# Altium schematic sheet System Power.SchDoc
size 297 x 209 mm; CompanyName: Sainsbury Wellcome Centre; Organization: FabLab; Address1: Sainsbury Wellcome Centre; Address2: 25 Howland Street; Address3: London; Address4: W1T 4JG; DocumentNumber: 2; SheetNumber: 2; SheetTotal: 3; swcgroup: FabLab; Org: Sainsbury Wellcome Centre; Add1: 25 Howland Street; Add2: London; Add3: W1T 4JG; WebAddress: www.sainsburywellcome.org; SheetSize: A4; SheetName: System Power
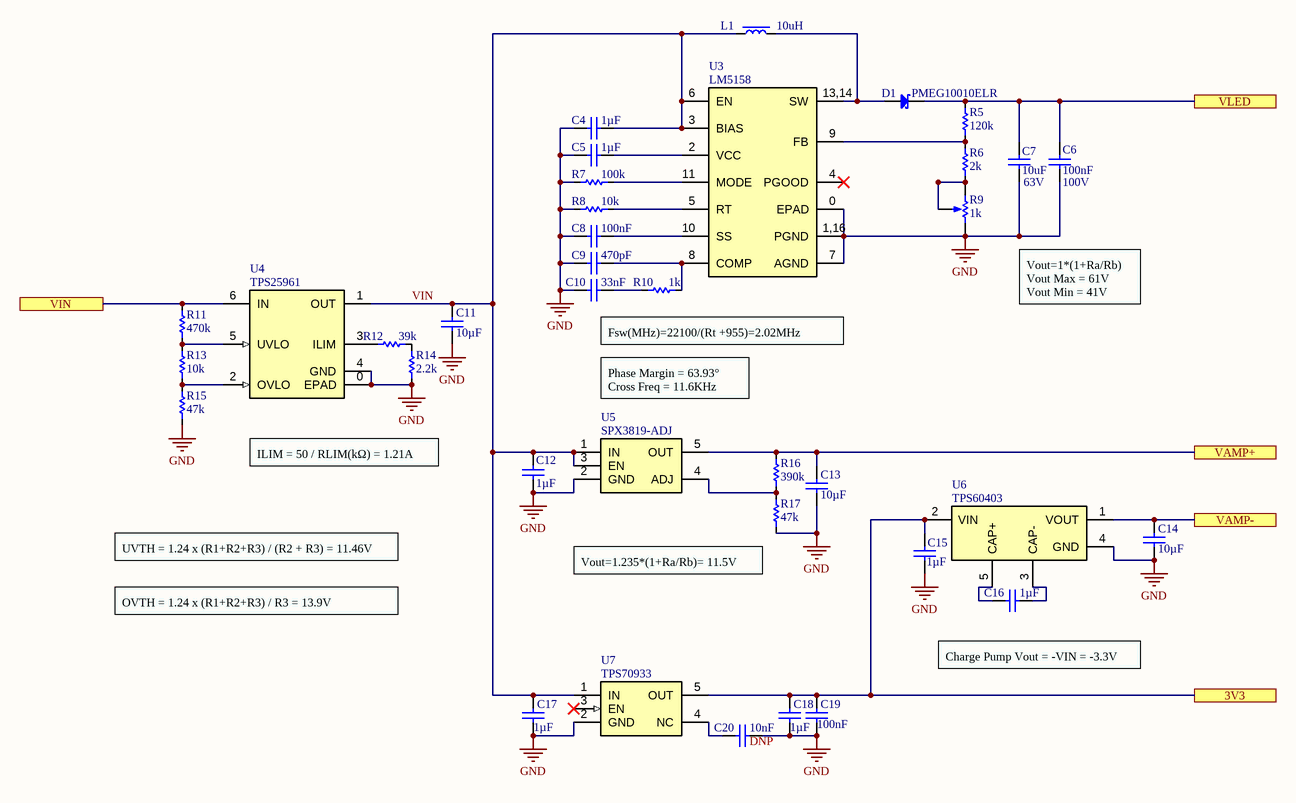
[diagram p0: System Power.SchDoc]

## Parts
C4  value 1µF  [CAP_CHIP_0603]  (hidden comment: C0603-1uF-50V)
C5  value 1µF  [CAP_CHIP_0603]  (hidden comment: C0603-1uF-50V)
C6  value 100nF  Voltage Rating: 100V  [CAP_CHIP_0603]  (hidden comment: C0603-100nF-100V)
C7  value 10uF  Voltage Rating: 63V  [CAP_CHIP_1210]  (hidden comment: C1210-10uF-63V)
C8  value 100nF  [CAP_CHIP_0603]  (hidden comment: C0603-100nF-50V)
C9  value 470pF  [CAP_CHIP_0603]  (hidden comment: C0603-470pF-25V)
C10  value 33nF  [CAP_CHIP_0603]  (hidden comment: C0603-33nF-50V)
C11  value 10µF  [CAP_CHIP_0603]  (hidden comment: C0603-10uF-25V)
C12  value 1µF  [CAP_CHIP_0603]  (hidden comment: C0603-1uF-50V)
C13  value 10µF  [CAP_CHIP_0603]  (hidden comment: C0603-10uF-25V)
C14  value 10µF  [CAP_CHIP_0603]  (hidden comment: C0603-10uF-25V)
C15  value 1µF  [CAP_CHIP_0603]  (hidden comment: C0603-1uF-50V)
C16  value 1µF  [CAP_CHIP_0603]  (hidden comment: C0603-1uF-50V)
C17  value 1µF  [CAP_CHIP_0603]  (hidden comment: C0603-1uF-50V)
C18  value 1µF  [CAP_CHIP_0603]  (hidden comment: C0603-1uF-50V)
C19  value 100nF  [CAP_CHIP_0603]  (hidden comment: C0603-100nF-50V)
C20  value 10nF  LCSC Part N.: DNP  [CAP_CHIP_0603]  (hidden comment: C0603-10nF-50V)
D1  PMEG10010ELR  [SOD123]
L1  value 10uH  [IND_PWR_0404]  (hidden comment: L-PWR-10uH-1.5A)
R5  value 120k  [RES_CHIP_0603]  (hidden comment: R0603-120K)
R6  value 2k  [RES_CHIP_0603]  (hidden comment: R0603-2K)
R7  value 100k  [RES_CHIP_0603]  (hidden comment: R0603-100K)
R8  value 10k  [RES_CHIP_0603]  (hidden comment: R0603-10K)
R9  value 1k  [VR_SMD_4.5mm]  (hidden comment: VR-SMD-1K-B)
R10  value 1k  [RES_CHIP_0603]  (hidden comment: R0603-1K)
R11  value 470k  [RES_CHIP_0603]  (hidden comment: R0603-470K)
R12  value 39k  [RES_CHIP_0603]  (hidden comment: R0603-39K)
R13  value 10k  [RES_CHIP_0603]  (hidden comment: R0603-10K)
R14  value 2.2k  [RES_CHIP_0603]  (hidden comment: R0603-2K2)
R15  value 47k  [RES_CHIP_0603]  (hidden comment: R0603-47K)
R16  value 390k  [RES_CHIP_0603]  (hidden comment: R0603-390K)
R17  value 47k  [RES_CHIP_0603]  (hidden comment: R0603-47K)
U3  LM5158  [QFN16_3X3_0.5E_EP]
U4  TPS25961  [WSON6]
U5  SPX3819-ADJ  [SOT23-5]
U6  TPS60403  [SOT23-5]
U7  TPS70933  [SOT23-5]

## Ports
3V3, VAMP+, VAMP-, VIN, VLED

## Nets
GND: C4.2 C5.2 C6.1 C7.1 C8.2 C9.2 C10.2 C11.2 C12.1 C13.2 C14.2 C15.2 C17.1 C18.1 C19.1 C20.1 R7.2 R8.2 R9.3(BOT) R14.1 R15.1 R17.1 U3.0(EPAD) U3.1,16(PGND) U3.7(AGND) U4.0(EPAD) U4.4(GND) U5.2(GND) U6.4(GND) U7.2(GND)
3V3: C15.1 C18.2 C19.2 U6.2(VIN) U7.5(OUT) ; port 3V3
VAMP+: C13.1 R16.2 U5.5(OUT) ; port VAMP+
VAMP-: C14.1 U6.1(VOUT) ; port VAMP-
VIN: C4.1 C11.1 C12.2 C17.2 L1.1 U3.3(BIAS) U3.6(EN) U4.1(OUT) U5.1(IN) U5.3(EN) U7.1(IN)
VIN: R11.2 U4.6(IN) ; port VIN  [a separate net that carries the same name]
VLED: C6.2 C7.2 D1.1(C) R5.2 ; port VLED
NetC5_1: C5.1 U3.2(VCC)
NetC8_1: C8.1 U3.10(SS)
NetC9_1: C9.1 R10.1 U3.8(COMP)
NetC10_1: C10.1 R10.2
NetC16_1: C16.1 U6.5(CAP+)
NetC16_2: C16.2 U6.3(CAP-)
NetC20_2: C20.2 U7.4(NC)
NetD1_2: D1.2(A) L1.2 U3.13,14(SW)
NetR5_1: R5.1 R6.2 U3.9(FB)
NetR6_1: R6.1 R9.1(TOP) R9.2(TAP)
NetR7_1: R7.1 U3.11(MODE)
NetR8_1: R8.1 U3.5(RT)
NetR11_1: R11.1 R13.2 U4.5(UVLO)
NetR12_1: R12.1 R14.2
NetR12_2: R12.2 U4.3(ILIM)
NetR13_1: R13.1 R15.2 U4.2(OVLO)
NetR16_1: R16.1 R17.2 U5.4(ADJ)

Not connected (* = marked no-connect by the designer): U3 4(PGOOD)*; U7 3(EN)*

## Notes on the sheet
- Vout=1*(1+Ra/Rb)
  Vout Max = 61V
  Vout Min = 41V
- Fsw(MHz)=22100/(Rt +955)=2.02MHz
- Phase Margin = 63.93°
  Cross Freq = 11.6KHz
- ILIM = 50 / RLIM(kΩ) = 1.21A
- UVTH = 1.24 x (R1+R2+R3) / (R2 + R3) = 11.46V
- (near R17) Vout=1.235*(1+Ra/Rb)= 11.5V
- OVTH = 1.24 x (R1+R2+R3) / R3 = 13.9V
- (near C16) Charge Pump Vout = -VIN = -3.3V
- FILE
- VARIANT
- DATE
- REVISION
- SHEET
- /
- PROJECT
- SIZE

## Library data of the parts
C4 C5 C12 C15-C18 = CMP-611-0033-11: 0603 Multilayer Ceramic Capacitors MLCC; PartNumber: CL10A105KB8NNNC; Pick&PlaceFootprint: C0603; Voltage Rating: 50V; Dielectric: X5R; Tolerance: 10%; Case/Package: 0603; RoHS: Yes; Capacitor Type: Ceramic; Mount: SMD; LCSC Part N.: C15849
C6 = CMP-611-0088-1: 0603 0.1 uF 100 V ±10% Tolerance X7R Multilayer Ceramic Capacitor; PartNumber: CC0603KRX7R0BB104; Pick&PlaceFootprint: C0603; Case/Package: 0603; LCSC Part N.: C113803; Tolerance: 10%; Dielectric: X7R; RoHS: Yes; Mount: SMD; Capacitor Type: Ceramic
C7 = CMP-611-0087-1: Multilayer Ceramic Capacitors MLCC - SMD/SMT 1210 10uF 63volts *Derate Voltage/Temp; PartNumber: GRM32ER71J106KA12L; Pick&PlaceFootprint: C1210; Dielectric: X7R; Tolerance: 10%; Mount: Surface Mount; Case/Package: 1210; LCSC Part N.: C437568; Capacitor Type: Ceramic
C8 C19 = CMP-611-0027-24: 0603 Multilayer Ceramic Capacitors MLCC; PartNumber: CC0603KRX7R9BB104; Tolerance: 10%; Pick&PlaceFootprint: C0603; Dielectric: X7R; Voltage Rating: 50V; Capacitor Type: Ceramic; RoHS: Yes; Mount: SMD; LCSC Part N.: C14663; Case/Package: 0603
C9 = CMP-611-0076-2: 25V 470pF X7R ±10% 0603 Multilayer Ceramic Capacitors MLCC - SMD/SMT ROHS; PartNumber: CC0603KRX7R8BB471; Pick&PlaceFootprint: C0603; RoHS: Yes; Capacitor Type: Ceramic; Dielectric: X7R; Mount: SMD; Case/Package: 0603; Tolerance: 10%; Voltage Rating: 25V; LCSC Part N.: C519413
C10 = CMP-611-0085-1: 0603 Multilayer Ceramic Capacitors MLCC; PartNumber: CL10B333KB8NNNC; Tolerance: 10%; Voltage Rating: 50V; Dielectric: X7R; Pick&PlaceFootprint: C0603; Case/Package: 0603; Mount: SMD; Capacitor Type: Ceramic; RoHS: Yes; LCSC Part N.: C21117
C11 C13 C14 = CMP-611-0050-6: 0603 Multilayer Ceramic Capacitors MLCC; PartNumber: CL10A106MA8NRNC; Dielectric: X5R; Pick&PlaceFootprint: C0603; Voltage Rating: 25V; Tolerance: 20%; Case/Package: 0603; LCSC Part N.: C96446; RoHS: Yes; Capacitor Type: Ceramic; Mount: SMD
C20 = CMP-611-0022-7: 0603 Multilayer Ceramic Capacitors MLCC; PartNumber: 0603B103K500NT; Pick&PlaceFootprint: C0603; Voltage Rating: 50V; Dielectric: X7R; Tolerance: 10%; Case/Package: 0603; RoHS: Yes; Capacitor Type: Ceramic; Mount: SMD
D1 = CMP-821-0014-1: On a Reel of 3000, Nexperia 100V 1.4A, Schottky Diode, 2-Pin SOD-123W PMEG10010ELRX; Rectified Current: 1A; Forward Voltage: 770mV; PartNumber: PMEG10010ELRX; Max Reverse Voltage: 100V; Pick&PlaceFootprint: SOD123; LCSC Part N.: C179426
L1 = CMP-620-0021-1: Inductor Power Shielded Wirewound 10uH 20% 100KHz Metal 1.5A 0.345Ohm DCR T/R; PartNumber: SPM4015T-100M-LR; DC Resistance (DCR): 345mR; Saturation Current: 1.9A; Tolerance: 20%; RMS Current (Irms): 1.5A; LCSC Part N.: C695172
R5 = CMP-633-0146-1: 100mW Thick Film Resistors 75V ±100ppm/℃ ±1% 0603 Chip Resistor; PartNumber: 0603WAF1203T5E; Number of Resistors: 1; Pick&PlaceFootprint: R0603; Voltage Rating: 75V; Mount: Surface Mount; Tolerance: 1%; LCSC Part N.: C25808; Power Rating: 100mW; Case/Package: 0603
R6 = CMP-633-0027-20: 100mW Thick Film Resistors 75V ±100ppm/℃ ±1% 0603 Chip Resistor; PartNumber: 0603WAF2001T5E; Pick&PlaceFootprint: R0603; Number of Resistors: 1; Mount: Surface Mount; Power Rating: 100mW; LCSC Part N.: C22975; Case/Package: 0603; Voltage Rating: 75V; Tolerance: 1%
R7 = CMP-633-0000-28: 100mW Thick Film Resistors 75V ±100ppm/℃ ±1% 0603 Chip Resistor; PartNumber: 0603WAF1003T5E; Number of Resistors: 1; Pick&PlaceFootprint: R0603; LCSC Part N.: C25803; Mount: Surface Mount; Voltage Rating: 75V; Power Rating: 100mW; Case/Package: 0603; Tolerance: 1%
R8 R13 = CMP-633-0002-26: 100mW Thick Film Resistors 75V ±100ppm/℃ ±1% 0603 Chip Resistor; PartNumber: 0603WAF1002T5E; Number of Resistors: 1; Pick&PlaceFootprint: R0603; Case/Package: 0603; Voltage Rating: 75V; Power Rating: 100mW; LCSC Part N.: C25804; Tolerance: 1%; Mount: Surface Mount
R9 = CMP-632-0009-1: Trimmer, Cermet, 0.25W, 1000ohm, 300V, 20% +/-Tol, -100,100ppm/Cel, 1 Turn(s), 2018; PartNumber: 3314J-1-102E; Power Rating: 250mW; Number of Turns: 1; Voltage Rating: 500V; Diameter: 4.5mm; Mount: SMD; RoHS: Yes; Type: B; Tolerance: 20%; Resistance: 1k; Case/Package: 2018; LCSC Part N.: C124640
R10 = CMP-633-0013-26: 100mW Thick Film Resistors 75V ±100ppm/℃ ±1% 0603 Chip Resistor; PartNumber: 0603WAF1001T5E; Pick&PlaceFootprint: R0603; Number of Resistors: 1; Voltage Rating: 75V; Case/Package: 0603; Tolerance: 1%; Mount: Surface Mount; LCSC Part N.: C21190; Power Rating: 100mW
R11 = CMP-633-0169-1: 100mW Thick Film Resistors 75V ±100ppm/℃ ±1% 0603 Chip Resistor; PartNumber: 0603WAF4703T5E; Number of Resistors: 1; Pick&PlaceFootprint: R0603; Case/Package: 0603; Mount: Surface Mount; Voltage Rating: 75V; LCSC Part N.: C23178; Tolerance: 1%; Power Rating: 100mW
R12 = CMP-633-0119-5: 100mW Thick Film Resistors 75V ±100ppm/℃ ±1% 0603 Chip Resistor; PartNumber: 0603WAF3902T5E; Pick&PlaceFootprint: R0603; Number of Resistors: 1; Tolerance: 1%; LCSC Part N.: C23153; Case/Package: 0603; Voltage Rating: 75V; Power Rating: 100mW; Mount: Surface Mount
R14 = CMP-633-0070-21: 100mW Thick Film Resistors 75V ±100ppm/℃ ±1% 0603 Chip Resistor; PartNumber: 0603WAF2201T5E; Pick&PlaceFootprint: R0603; Number of Resistors: 1; Power Rating: 100mW; Mount: Surface Mount; Voltage Rating: 75V; Tolerance: 1%; LCSC Part N.: C4190; Case/Package: 0603
R15 R17 = CMP-633-0052-25: 100mW Thick Film Resistors 75V ±100ppm/℃ ±1% 0603 Chip Resistor; PartNumber: 0603WAF4702T5E; Pick&PlaceFootprint: R0603; Number of Resistors: 1; Tolerance: 1%; Voltage Rating: 75V; LCSC Part N.: C25819; Mount: Surface Mount; Power Rating: 100mW; Case/Package: 0603
R16 = CMP-633-0143-1: 100mW Thick Film Resistors 75V ±100ppm/℃ ±1% 0603 Chip Resistor; PartNumber: 0603WAF3903T5E; Pick&PlaceFootprint: R0603; Number of Resistors: 1; Mount: Surface Mount; LCSC Part N.: C23150; Power Rating: 100mW; Voltage Rating: 75V; Tolerance: 1%; Case/Package: 0603
U3 = CMP-970-0074-1: 5-A, 40-V, wide VIN boost, flyback, & SEPIC converter 16-WQFN -40 to 150; PartNumber: LM5158QRTERQ1; Switching Frequency: 2.2MHz; Max Output current: 3.75A; Max Input Voltage: 60V; RDS(On): 300mR; Max Output Voltage: 83V; Min Input Voltage: 1.5V; Reference Voltage: 1V; LCSC Part N.: C3188431; Switcher Configuration: Boost
U4 = CMP-970-0077-1: 2.7-V–19-V, 106-mΩ, eFuse With Adjustable Current Limit and Short-Circuit; PartNumber: TPS25961DRVR; Max Output Current: 2A; RDS ON: 106mR; Min Input Voltage: 2.7V; Max Input Voltage: 19V; LCSC Part N.: C5571272; Pick&PlaceFootprint: WSON6
U5 = CMP-970-0038-1: Adjustable Positive LDO Regulator, 0.7V Dropout, PDSO5; PartNumber: SPX3819M5-L; Quiescent Current: 8uA; Dropout Voltage: 700mV; PSRR: 70dB; Line Regulation: 0.04%; Output Noise: 40uV; Max Output Current: 800mA; Accuracy: 1%; Max Input Voltage: 16V; Load Regulation: 0.05%; LCSC Part N.: C9056; Output Type: Adjustable; Pick&PlaceFootprint: SOT23-5
U6 = CMP-970-0067-1: 60mA Charge Pump Voltage Inverter with Fixed 250kHz Operation 5-SOT-23 -40 to 85; PartNumber: TPS60403DBVR; Min Output Voltage: -1.8V; Min Input Voltage: 1.8V; Max Input Voltage: 5.25V; Switcher Configuration: Charge Pump; LCSC Part N.: C11338; Max Output current: 60mA; Switching Frequency: 250kHz
U7 = CMP-970-0051-1: LDO Regulator Pos 3.3V 0.15A 5-Pin SOT-23 T/R; PartNumber: TPS70933DBVR; Quiescent Current: 1uA; Output Type: Fixed; Load Regulation: 0.6%; PSRR: 80dB; Line Regulation: 0.1%; Max Output Current: 150mA; Accuracy: 2%; Output Noise: 0.19mV; Dropout Voltage: 960mV; Max Input Voltage: 30V; LCSC Part N.: C89347; Output Voltage: 3.3V